# Altium schematic sheet 105848.SchDoc: Tester Control Board
size Letter; CheckedBy: DMH; Author: DMH; CompanyName: DETEX; DrawnBy: DMH; Engineer: DMH; Address1: DETEX CORP; Address2: 302 DETEX DR; Address3: NEW BRAUNFELS, TX; Address4: (830) 629-2900; DocumentNumber: Tester Control Board; Revision: D4; SheetNumber: 1; SheetTotal: 1
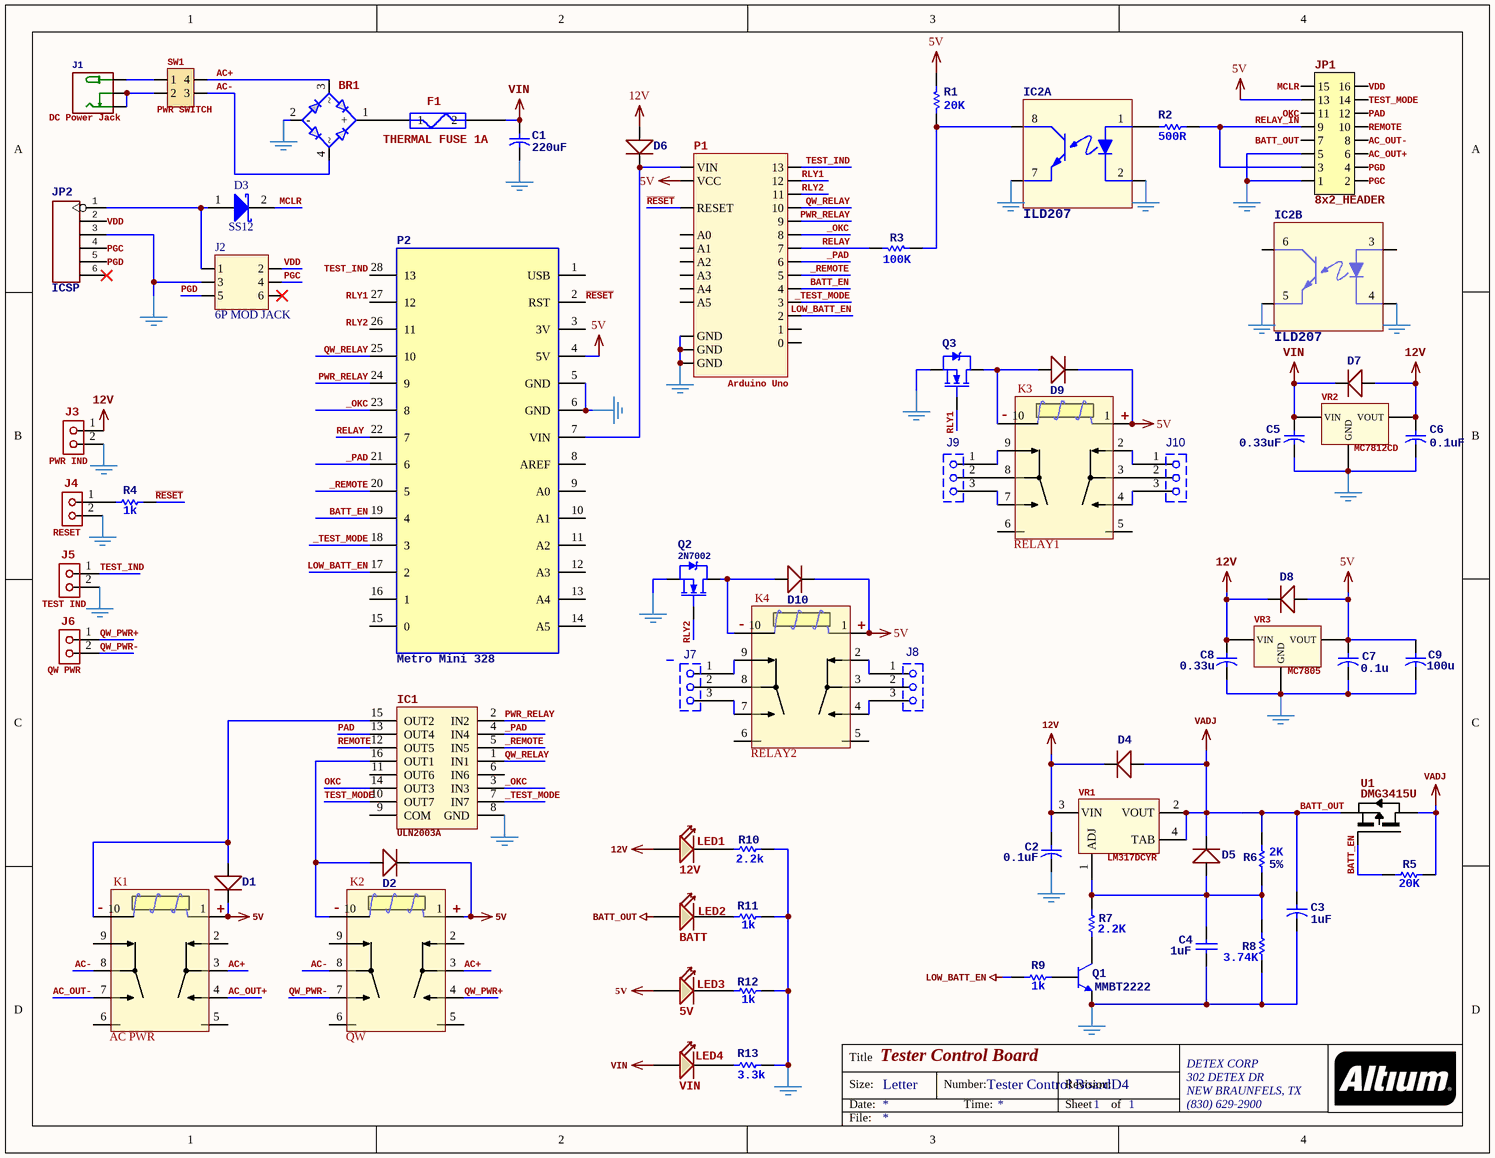
[diagram p0: 105848.SchDoc]

## Parts
BR1  BRIDGE - SMT  [BRIDGE_1A_SMT]  (value not drawn)
C1  value 220uF  [CAPR5-4X5]  (hidden comment: Capacitor - Thru-Hole)
C2  value 0.1uF  [CAPC1206(3216)110_M]  (hidden comment: 1206 Capacitor)
C3  value 1uF  [CAPC1206(3216)110_M]  (hidden comment: 1206 Capacitor)
C4  value 1uF  [CAPC1206(3216)110_M]  (hidden comment: 1206 Capacitor)
C5  value 0.33uF  [RESC1206(3216)_M]  (hidden comment: 1206 Capacitor)
C6  value 0.1uF  [RESC1206(3216)_M]  (hidden comment: 1206 Capacitor)
C7  value 0.1u  [RESC1206(3216)_M]  (hidden comment: 1206 Capacitor)
C8  value 0.33u  [RESC1206(3216)_M]  (hidden comment: 1206 Capacitor)
C9  value 100u  [CAPR5-4X5]  (hidden comment: Capacitor - Thru-Hole)
D1  BAS20  [SOT-23_M]  (value not drawn)
D2  BAS20  [SOT-23_M]  (value not drawn)
D3  SS12  [SMB_2]
D4  1N4002  [DO-214AC]  (value not drawn)
D5  1N4002  [DO-214AC]  (value not drawn)
D6  1N4002  [DO-214AC]  (value not drawn)
D7  1N4002  [DO-214AC]  (value not drawn)
D8  1N4002  [DO-214AC]  (value not drawn)
D9  BAS20  [SOT-23_M]  (value not drawn)
D10  BAS20  [SOT-23_M]  (value not drawn)
F1  THERMAL FUSE 1A  [FUSE_200]
IC1  ULN2003A  [SO-16_M]
IC2  ILD207  [SO8_N]  (parts A,B of 2)
J1  DC Power Jack  [KLD-0202_2]
J2  6P MOD JACK  [TECO-5520470-3_V]
J3  PWR IND  [JMP2]
J4  RESET  [JMP2]
J5  TEST IND  [JMP2]
J6  QW PWR  [JMP2]
J7  JMP_3PIN  [JMP3]  (value not drawn)
J8  JMP_3PIN  [JMP3]  (value not drawn)
J9  JMP_3PIN  [JMP3]  (value not drawn)
J10  JMP_3PIN  [JMP3]  (value not drawn)
JP1  8x2_HEADER  [HDR2X8]
JP2  ICSP  [HDR1X6]
K1  AC PWR  [AZ_940]
K2  QW  [AZ_940]
K3  RELAY1  [AZ_940]
K4  RELAY2  [AZ_940]
LED1  12V  [LED-0805]
LED2  BATT  [LED-0805]
LED3  5V  [LED-0805]
LED4  VIN  [LED-0805]
P1  Arduino Uno  [ArduinoUno]
P2  Metro Mini 328  [Adafruit Metro Mini]
Q1  MMBT2222  [SOT-23_M]
Q2  2N7002  [SOT-23_M]
Q3  2N7002  [SOT-23_M]  (value not drawn)
R1  value 20K  [RESC1206(3216)_M]  (hidden comment: Resistor)
R2  value 500R  [RESC1206(3216)_M]  (hidden comment: Resistor)
R3  value 100K  [RESC1206(3216)_M]  (hidden comment: Resistor)
R4  value 1k  [RESC1206(3216)_M]  (hidden comment: Resistor)
R5  value 20K  [RESC1206(3216)_M]  (hidden comment: Resistor)
R6  value 2K  Tolerance: 5%  [RESC1206(3216)_M]  (hidden comment: Resistor)
R7  value 2.2K  [RESC1206(3216)_M]  (hidden comment: Resistor)
R8  value 3.74K  [RESC1206(3216)_M]  (hidden comment: Resistor)
R9  value 1k  [RESC1206(3216)_M]  (hidden comment: Resistor)
R10  value 2.2k  [RESC1206(3216)_M]  (hidden comment: Resistor)
R11  value 1k  [RESC1206(3216)_M]  (hidden comment: Resistor)
R12  value 1k  [RESC1206(3216)_M]  (hidden comment: Resistor)
R13  value 3.3k  [RESC1206(3216)_M]  (hidden comment: Resistor)
SW1  PWR SWITCH  [DPST-4]  (no BOM)
U1  MPN: DMG3415U  [SOT-23_M]  (hidden comment: MOSFET P-CHANNEL)
VR1  LM317DCYR  [SOT223_M]
VR2  MC7812CD  [D2PAK]
VR3  MC7805  [D2PAK]

## Nets
5V: C7.1 C9.1 D1.- D2.- D8.+ D9.- D10.- JP1.13 K1.1(V+) K2.1(V+) K3.1(V+) K4.1(V+) LED3.+ P1.VCC P2.4(5V) R1.1 VR3.3(VOUT)
12V: C2.1 C6.1 C8.1 D4.- D6.+ D7.+ D8.- J3.1 LED1.+ VR1.3(VIN) VR2.3(VOUT) VR3.1(VIN)
BATT_OUT: C3.1 D4.+ D5.- JP1.7 LED2.+ R5.2 R6.1 U1.2 U1.3 VR1.2(VOUT) VR1.4(TAB)  [also labelled VADJ]
GND: BR1.2(-) C1.2 C2.2 C3.2 C4.1 C5.2 C6.2 C7.2 C8.2 C9.2 IC1.8(GND) IC2.2(C1) IC2.4(C2) IC2.5(E2) IC2.7(E1) J2.3 J3.2 J4.2 J5.2 JP1.1 JP1.5 JP2.3 P1.GND P1.GND1(GND) P1.GND2(GND) P2.5(GND) P2.6(GND) Q1.2 Q2.2(S) Q3.2(S) R8.2 R10.2 R11.2 R12.2 R13.2 VR2.2(GND) VR3.2(GND)
LOW_BATT_EN: P1.2 P2.17(2) R9.1
VIN: C1.1 C5.1 D7.- F1.2 LED4.+ VR2.1(VIN)
_OKC: IC1.3(IN3) P1.8 P2.23(8)
_PAD: IC1.4(IN4) P1.6 P2.21(6)
_REMOTE: IC1.5(IN5) P1.5 P2.20(5)
_TEST_MODE: IC1.7(IN7) P1.3 P2.18(3)
AC+: BR1.3 K1.3(COM) K2.3(COM) SW1.4
AC-: BR1.4 K1.8(COM) K2.8(COM) SW1.3
AC_OUT+: JP1.6 K1.4(N/O)
AC_OUT-: JP1.8 K1.7(N/O)
BATT_EN: P1.4 P2.19(4) R5.1 U1.1
MCLR: D3.2(K) JP1.15
OKC: IC1.14(OUT3) JP1.11
PAD: IC1.13(OUT4) JP1.12
PGC: J2.4 JP1.2 JP2.4
PGD: J2.5 JP1.4 JP2.5
PWR_RELAY: IC1.2(IN2) P1.9 P2.24(9)
QW_PWR+: J6.1 K2.4(N/O)
QW_PWR-: J6.2 K2.7(N/O)
QW_RELAY: IC1.1(IN1) P1.10 P2.25(10)
~{RESET}: P1.RESET P2.2(RST) R4.2
RELAY: P1.7 P2.22(7) R3.2
RELAY_IN: JP1.3 JP1.9 R2.1
REMOTE: IC1.12(OUT5) JP1.10
RLY1: P1.12 P2.27(12) Q3.1(G)
RLY2: P1.11 P2.26(11) Q2.1(G)
TEST_IND: J5.1 P1.13 P2.28(13)
TEST_MODE: IC1.10(OUT7) JP1.14
VDD: J2.2 JP1.16 JP2.2
NetBR1_1: BR1.1(+) F1.1
NetC4_2: C4.2 D5.+ R6.2 R7.1 R8.1 VR1.1(ADJ)
NetD1_+: D1.+ IC1.15(OUT2) K1.10(V-)
NetD2_+: D2.+ IC1.16(OUT1) K2.10(V-)
NetD3_1: D3.1(A) J2.1 JP2.1
NetD6_-: D6.- P1.VIN P2.7(VIN)
NetD9_+: D9.+ K3.10(V-) Q3.3(D)
NetD10_+: D10.+ K4.10(V-) Q2.3(D)
NetIC2_1: IC2.1(A1) R2.2
NetIC2_8: IC2.8(COL1) R1.2 R3.1
NetJ1_+: J1.+ SW1.1
NetJ1_-1: J1.-1(-) J1.-2(CDN) SW1.2
NetJ4_1: J4.1 R4.1
NetJ7_1: J7.1 K4.9(N/C)
NetJ7_2: J7.2 K4.8(COM)
NetJ7_3: J7.3 K4.7(N/O)
NetJ8_1: J8.1 K4.2(N/C)
NetJ8_2: J8.2 K4.3(COM)
NetJ8_3: J8.3 K4.4(N/O)
NetJ9_1: J9.1 K3.9(N/C)
NetJ9_2: J9.2 K3.8(COM)
NetJ9_3: J9.3 K3.7(N/O)
NetJ10_1: J10.1 K3.2(N/C)
NetJ10_2: J10.2 K3.3(COM)
NetJ10_3: J10.3 K3.4(N/O)
NetLED1_-: LED1.- R10.1
NetLED2_-: LED2.- R11.1
NetLED3_-: LED3.- R12.1
NetLED4_-: LED4.- R13.1
NetQ1_1: Q1.1 R9.2
NetQ1_3: Q1.3 R7.2

Not connected (* = marked no-connect by the designer): IC1 6(IN6) 9(COM) 11(OUT6); IC2 3(A2) 6(COL2); J2 6*; JP2 6*; K1 2(N/C) 5 6 9(N/C); K2 2(N/C) 5 6 9(N/C); K3 5 6; K4 5 6; P1 0 1 A0 A1 A2 A3 A4 A5; P2 1(USB) 3(3V) 8(AREF) 9(A0) 10(A1) 11(A2) 12(A3) 13(A4) 14(A5) 15(0) 16(1)

## Notes on the sheet
- Title
- Size:
- Date:
- Letter
- Number:
- Time:
- Revision:
- Sheet
- of
- File:
- (in symbol Relay_1) -; +

## Library data of the parts
BR1 = BRIDGE_1A_SMT: 1A SMT Bridge Rectifier; Value: 1A SMT Bridge Rectifier
C1 C9 = CAP200: Capacitor TO - 200 SPACING
C2 C3 C5-C8 = CAP200: 1206 Ceramic Capacitor; PackageDescription: 1206; PackageReference: 1206
C4 = Cap: 1206 Ceramic Capacitor; PackageDescription: 1206; PackageReference: 1206
D1 D2 D10 = SMD-DIODE-SCHOTTKY-20V-1A(SOD-123): pin to pad: +>1 ->3; MPN: B5819W; Value: BAS20; PackageDescription: SOT-23
D3 = D Schottky: Schottky Diode, SMD; PackageReference: SMA; PackageDescription: SMB; MPN: SS12; ComponentLink1Description: Datasheet; ComponentLink1URL: https://www.vishay.com/docs/88746/ss12.pdf; Value: SS12
D4-D8 = SMD-DIODE-SCHOTTKY-20V-1A(SOD-123): Diode, SMD; MPN: B5819W; Value: 1N4002; PackageDescription: SMB
D9 = SMD-DIODE-SCHOTTKY-20V-1A(SOD-123): Diode, SMD; pin to pad: +>1 ->3; MPN: B5819W; Value: BAS20; PackageDescription: SOT-23
F1 = FUSE_200: Value: 1A fuse
IC1 = ULN2003: ComponentLink1Description: Datasheet; ComponentLink1URL: https://www.diodes.com/assets/Datasheets/ULN200xA.pdf; Value: ULN2003A; MPN: ULN2003A; PackageDescription: SO-16
IC2 = OPTO_DUAL_2: DUAL OPTO ISOLATOR; Value: ILD207T; ComponentLink1Description: Datasheet; ComponentLink1URL: http://www.vishay.com/docs/83647/ild205t.pdf; MPN: ILD207T; PackageDescription: SO8
J1 = CONN-POWER-JACK-2.1MM(DC-005): DC POWER PLUG; pin to pad: +>1 -1>2 -2>3; MPN: DC-005; Value: KLD-0202_2
J2 = Modular Jack 6P: 6 Position Modular Jack Connector; Manufacturer: Tetco; Value: TECO-5520470-3_V; MPN: TECO-5520470-3_V
J3-J6 = JUMPER_2: Value: JUMPER_2
JP1 = 15C_2ROW_HEADER: Ribbon Cable Connection; Value: 8x2_HEADER
JP2 = DIP-BLACK-MALE-HEADER(6P-2.54): MPN: P125-1106A1BS116A1; Value: ICSP
K1-K4 = Relay_1: AZ850-5; Part Number: 101671; Manufacturer: Zetler; ComponentLink1Description: Datasheet; ComponentLink1URL: http://www.azettler.com/pdfs/az850.pdf; Value: AZ850-5; MPN: AZ850-5
LED1 = SMD-LED-CLEAR-RED(0805): 12V Power Indicator; MPN: 17-215SURC/S530-A2/TR8; Value: LED-0805; PackageDescription: 0805; PackageReference: 0805
LED2 = SMD-LED-CLEAR-RED(0805): Battery Power Indicator; MPN: 17-215SURC/S530-A2/TR8; Value: LED-0805; PackageDescription: 0805; PackageReference: 0805
LED3 = SMD-LED-CLEAR-RED(0805): 5V Power Indicator; MPN: 17-215SURC/S530-A2/TR8; Value: LED-0805; PackageDescription: 0805; PackageReference: 0805
LED4 = SMD-LED-CLEAR-RED(0805): Power Input Indicator; MPN: 17-215SURC/S530-A2/TR8; Value: LED-0805; PackageDescription: 0805; PackageReference: 0805
P1 = Arduino Uno: Manufacturer: Arduino.cc; Value: Arduino Uno
P2 = Metro Mini: Adafruit METRO Mini 328 rev A; MPN: 2590; Manufacturer: Adafruit Industries; ComponentLink1URL: https://github.com/adafruit/Adafruit-METRO-328-PCB/raw/master/Metro%20Mini%20Rev%20A.pdf; ComponentLink1Description: Datasheet; Value: Metro Mini 328
Q1 = 2N3904_SMT: NPN Bipolar Transistor; Value: MMBT2222; MPN: MMBT2222; ComponentLink1Description: Datasheet; ComponentLink1URL: http://datasheet.octopart.com/MMBT2222-Fairchild-datasheet-39713.pdf; PackageDescription: SOT-23; PackageReference: SOT-23
Q2 Q3 = NMOS-2: N-Channel Enhancement Mode FET; PackageReference: SOT-23; PackageDescription: SOT-23; ComponentLink1Description: Datasheet; ComponentLink1URL: http://www.onsemi.com/pub/Collateral/NDS7002A-D.PDF; MPN: 2N7002; Value: 2N7002
R1-R5 R7-R13 = CMP-2003-01077-1: RESISTOR, SMD, 1206; Tolerance: 5%; PackageDescription: 1206; PackageReference: 1206
R6 = CMP-2003-01077-1: RESISTOR, SMD, 1206; PackageDescription: 1206; PackageReference: 1206
SW1 = Header 2x2: Wire-Board Connection; Value: Header 2x2; PackageDescription: 1206; PackageReference: 1206
U1 = P-CHANNEL MOSFET: Manufacturer: Diodes, Inc.; Value: DMG3415U; ComponentLink1Description: Datasheet; ComponentLink1URL: https://www.diodes.com/assets/Datasheets/ds31735.pdf; PackageDescription: SOT-23; PackageReference: SOT-23
VR1 = LM317: Adjustable SMT Voltage Regulator; Manufacturer: TI; MPN: LM317DCYR; ComponentLink1URL: http://www.ti.com/lit/ds/symlink/lm317.pdf; ComponentLink1Description: Datasheet; Value: LM317DCYR; PackageDescription: SOT-23-4; PackageReference: SOT-23-4
VR2 = MC7812: SMT 12V Fixed Output Voltage Regulator; MPN: MC7812CD2TG; Manufacturer: ON Semi; Value: MC7812CD2TG; ComponentLink1URL: https://www.onsemi.com/pub/Collateral/MC7800-D.PDF; ComponentLink1Description: Datasheet; PackageDescription: DPAK; PackageReference: DPAK
VR3 = MC7812: SMT 5V Linear Voltage Regulator; MPN: MC7805BDTRKG; Manufacturer: ON Semi; Value: MC7805BDTRKG; ComponentLink1URL: https://www.onsemi.com/pub/Collateral/MC7800-D.PDF; ComponentLink1Description: Datasheet; PackageDescription: DPAK-3; PackageReference: DPAK-3
J7-J10 = JMP_3PIN: Value: JMP_3PIN